# EAGLE design I-Bus Adapter with Power Supply (EAGLE 6.4)
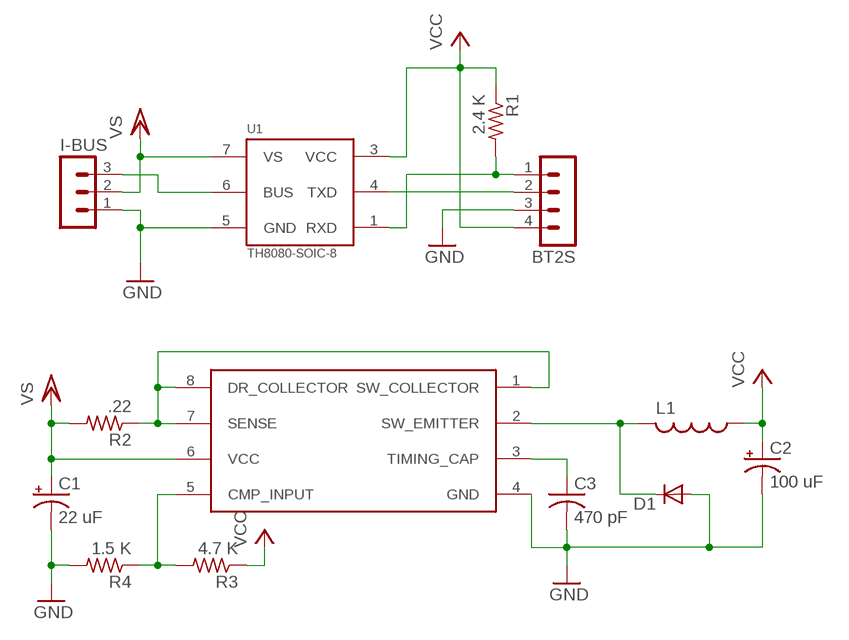
[diagram p0: schematic, sheet 1]

## Parts
BT2S  MA04-1  [MA04-1]
C1  22 uF  CPOL-USE1.8-4  [E1,8-4]
C2  100 uF  CPOL-USE1.8-4  [E1,8-4]
C3  470 pF  C-USC0603K  [C0603K]
D1  DIODE-D-2.5  [D-2.5]
I-BUS  MA03-1  [MA03-1]
L1  L-US0207/2V  [0207/2V]
R1  2.4 K  R-US_R1206  [R1206]
R2  .22  R-US_R1206  [R1206]
R3  4.7 K  R-US_R2012  [R2012]
R4  1.5 K  R-US_R2012  [R2012]
U1  TH8080-SOIC-8  [SO-8]
U2  MC34063-SOIC-8  [SO-8]

## Nets
GND: BT2S.3 C1.- C2.- C3.2 D1.A I-BUS.1 R4.2 U1.5(GND) U2.4(GND)
N$1: BT2S.1 R1.2 U1.1(RXD)
N$2: BT2S.2 U1.4(TXD)
N$3: R2.1 U2.1(SW_COLLECTOR) U2.7(SENSE) U2.8(DR_COLLECTOR)
N$4: I-BUS.3 U1.6(BUS)
N$6: D1.C L1.2 U2.2(SW_EMITTER)
N$7: R3.2 R4.1 U2.5(CMP_INPUT)
N$8: C3.1 U2.3(TIMING_CAP)
VCC: BT2S.4 C2.+ L1.1 R1.1 R3.1 U1.3(VCC)
VCC/2: C1.+ I-BUS.2 R2.2 U1.7(VS) U2.6(VCC) ; supply symbol labelled VS

## Library data of the parts
BT2S = con-lstb:MA04-1: PIN HEADER; OC_FARNELL: unknown; OC_NEWARK: unknown
C1 C2 = rcl:CPOL-US: POLARIZED CAPACITOR, American symbol
C3 = rcl:C-US: CAPACITOR, American symbol
D1 = diode:DIODE-: DIODE
I-BUS = con-lstb:MA03-1: PIN HEADER; OC_FARNELL: unknown; OC_NEWARK: unknown
L1 = rcl:L-US: INDUCTOR, American symbol
R1-R4 = rcl:R-US_: RESISTOR, American symbol
U1 = TH-8080:TH8080-SOIC-8
U2 = MC34063:MC34063-SOIC-8

## Board
I-Bus Adapter Copyright (c) 2013 by David Barksdale. This work is made available under the terms of the Creative Commons Attribution-ShareAlike 3.0 license, http://creativecommons.org/licenses/by-sa/3.0/.
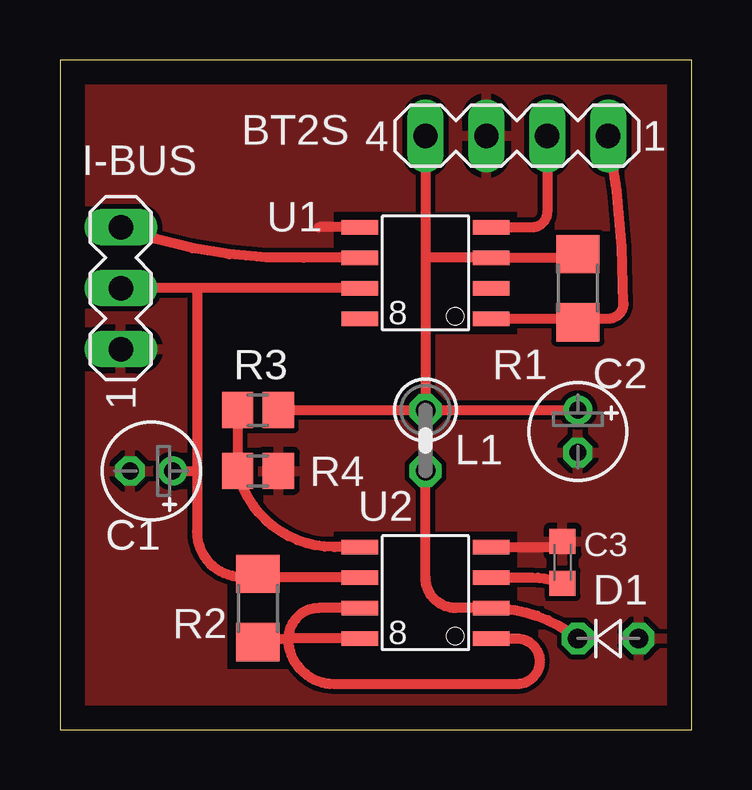
[diagram p1: board, top side]

Size 26.34 x 27.93 mm. Coordinates in mm from the lower left corner, seen from the top.
Outline: 0,0 26.34,0 26.34,27.93 0,27.93 0,0
Copper layers (1*16): Top 0.035mm / dielectric 1.5mm / Bottom 0.035mm
Design rules "default": minimum track width 10mil, minimum drill 24mil, track to track 8mil, track to pad 8mil, pad to pad 8mil, via to via 8mil, smd to smd 8mil, copper to edge 40mil, drill to drill 8mil, minimum pad ring 10mil, minimum via ring 8mil, stop-mask expansion 4mil, vias tented up to drill 0mil, thermal gap 10mil
tRestrict: area 11.4,16.5 to 19.1,21.6; area 11.4,3.2 to 19.1,8.3; area 7,2.5 to 9.5,7.6

### Footprints (pad centres in the part's own frame; a part is rotated, then mirrored left to right if it is on the bottom)
MA04-1 = drill 1.016 long: 1 -3.81,0; 2 -1.27,0; 3 1.27,0; 4 3.81,0
E1,8-4 = drill 0.711 pad 1.168: + -0.889,0 | drill 0.711 pad 1.168 octagon: - 0.889,0
C0603K = smd 1.05 x 1.08: 1 -0.875,0; 2 0.875,0
D-2.5 = drill 0.813 octagon: A 1.27,0; C -1.27,0
MA03-1 = drill 1.016 long: 1 -2.54,0; 2 0,0; 3 2.54,0
0207/2V = drill 0.813 octagon: 1 -1.27,0; 2 1.27,0
R1206 = smd 1.6 x 1.803: 1 -1.422,0; 2 1.422,0
R2012 = smd 1.3 x 1.5: 1 -0.85,0; 2 0.85,0
SO-8 = smd 1.524 x 0.61: 1 -2.743,1.27; 2 -2.743,0; 3 -2.743,-1.27; 4 -2.743,-2.54; 5 2.743,-2.54; 6 2.743,-1.27; 7 2.743,0; 8 2.743,1.27

### Placement (x,y rotation side)
BT2S  19.05,24.77 180 top
C1  3.81,10.79 180 top
C2  21.59,12.45 270 top
C3  20.95,6.99 90 top
D1  22.86,3.81 0 top
I-BUS  2.54,18.41 90 top
L1  15.24,12.07 270 top
R1  21.59,18.41 270 top
R2  8.26,5.08 90 top
R3  8.26,13.34 180 top
R4  8.26,10.79 0 top
U1  15.24,18.41 180 top
U2  15.24,5.08 180 top

### Tracks (layer width: path | path; a pad name or v marks a point on that pad's centre or on a via)
GND
  Top 0.406: C3.2 arc-41 20.32,7.62 U2.4 | U1.5 10.79,20.95
  pour Top: -0.64,28.57 26.67,28.57 26.67,-0.64 -0.64,-0.64
N$1
  Top 0.406: U1.1 21.59,17.14 | 21.59,17.14 R1.2 | 21.59,17.14 22.86,17.14 arc90 23.5,17.78 arc10 BT2S.1
N$2
  Top 0.406: U1.4 19.68,20.95 arc90 20.32,21.59 BT2S.2
N$3
  Top 0.406: U2.7 10.79,5.08 arc90 9.53,3.81 | U2.8 9.53,3.81 | 9.53,3.81 R2.1 | U2.1 19.05,3.81 arc-180 19.05,1.91 11.43,1.91 arc-90 9.53,3.81
N$4
  Top 0.406: U1.6 10.16,19.68 arc-23 I-BUS.3
N$6
  Top 0.406: L1.2 15.24,6.35 arc90 16.51,5.08 U2.2 arc-39 D1.C
N$7
  Top 0.406: U2.5 11.43,7.62 arc-77 R4.1 R3.2
N$8
  Top 0.406: U2.3 19.68,6.35 arc-21 C3.1
VCC
  Top 0.406: R3.1 L1.1 | L1.1 C2.+ | BT2S.4 15.24,19.68 | 15.24,19.68 L1.1 | R1.1 21.59,19.68 U1.3 15.24,19.68
VCC/2
  Top 0.406: U2.6 8.89,6.35 arc-27 R2.2 arc-111 5.71,8.26 5.71,10.79 | U1.7 5.71,18.41 | 5.71,18.41 I-BUS.2 | 5.71,18.41 5.71,10.79 | C1.+ 5.71,10.79